# Altium schematic sheet Sheet1.SchDoc
size A1; SheetNumber: 1; SheetTotal: 1
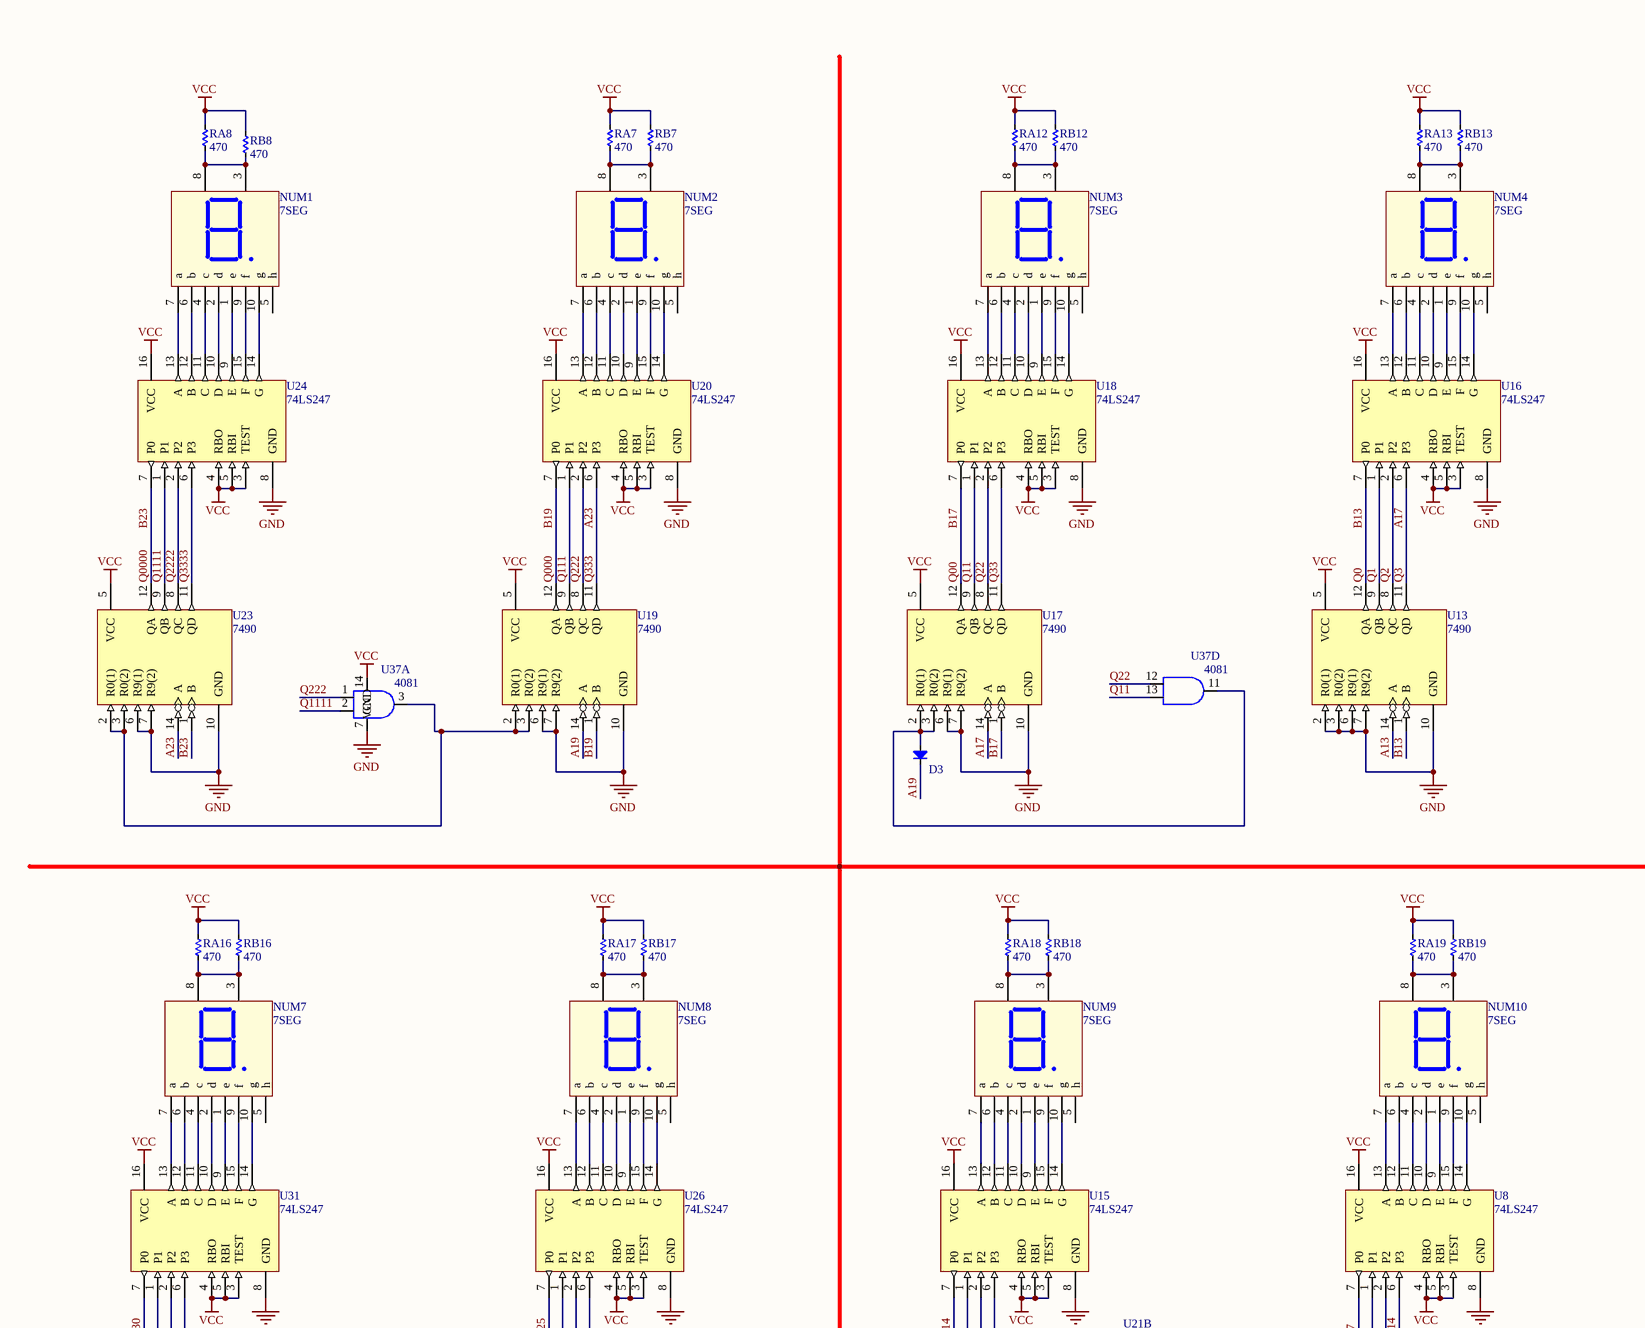
[diagram p0: Sheet1.SchDoc, top left]
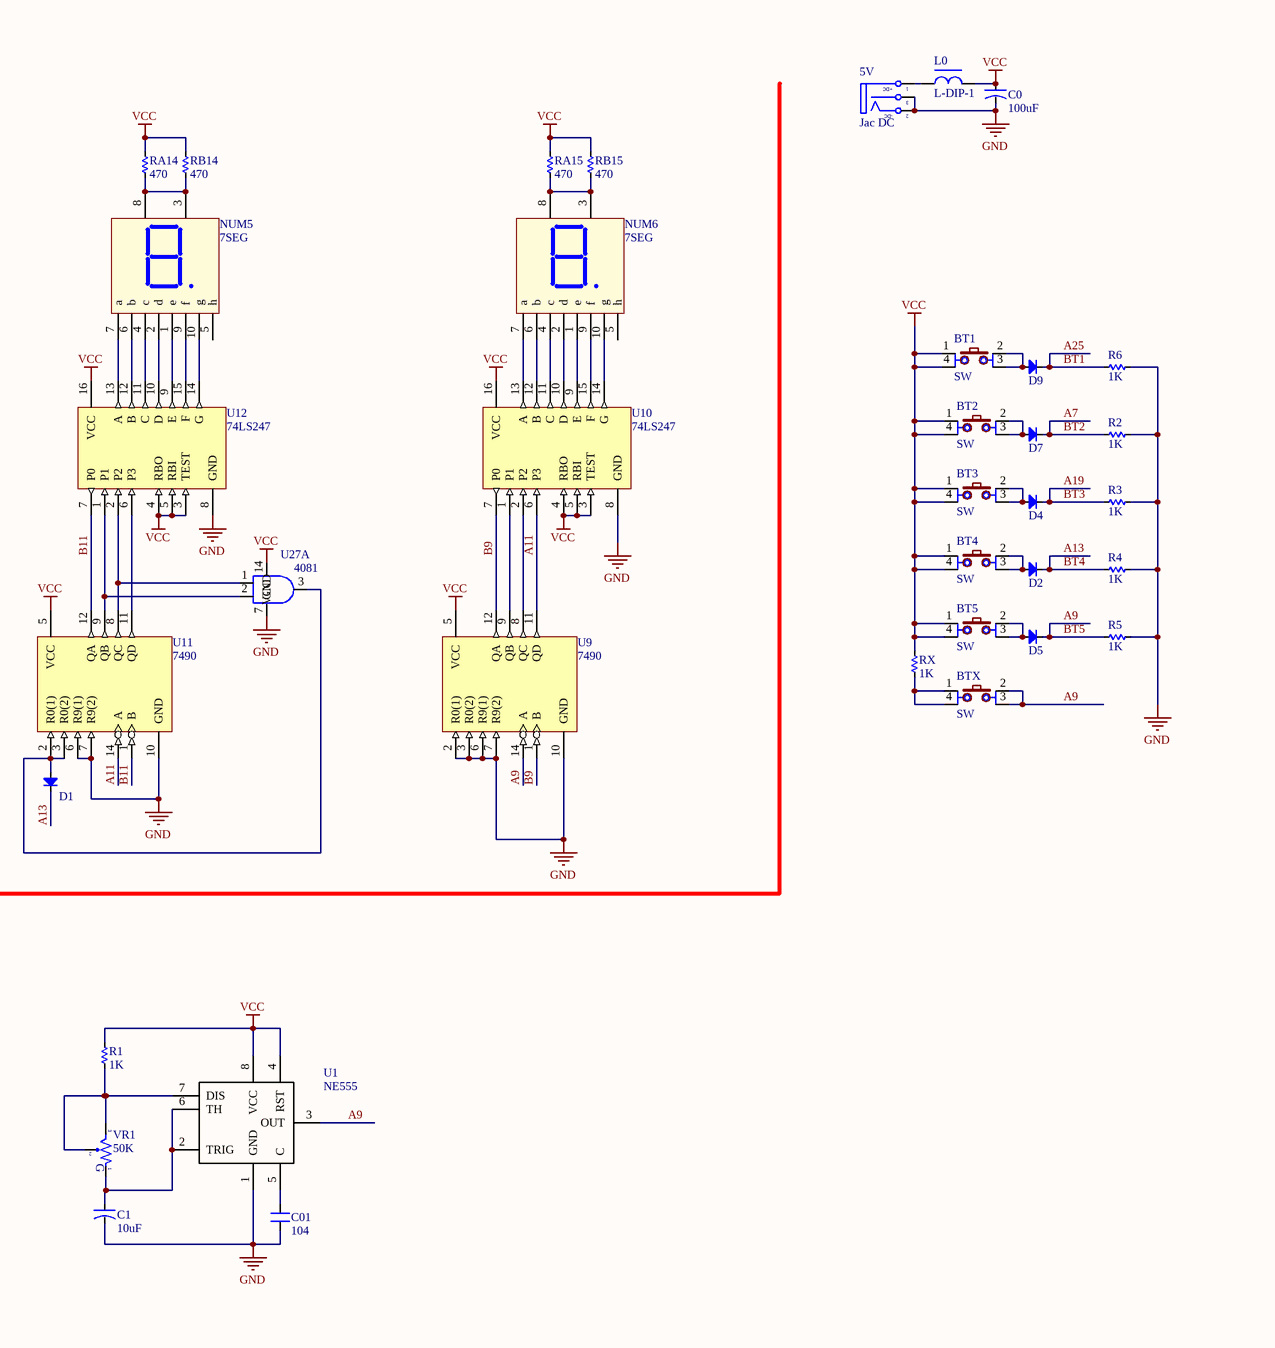
[diagram p1: Sheet1.SchDoc, top right]
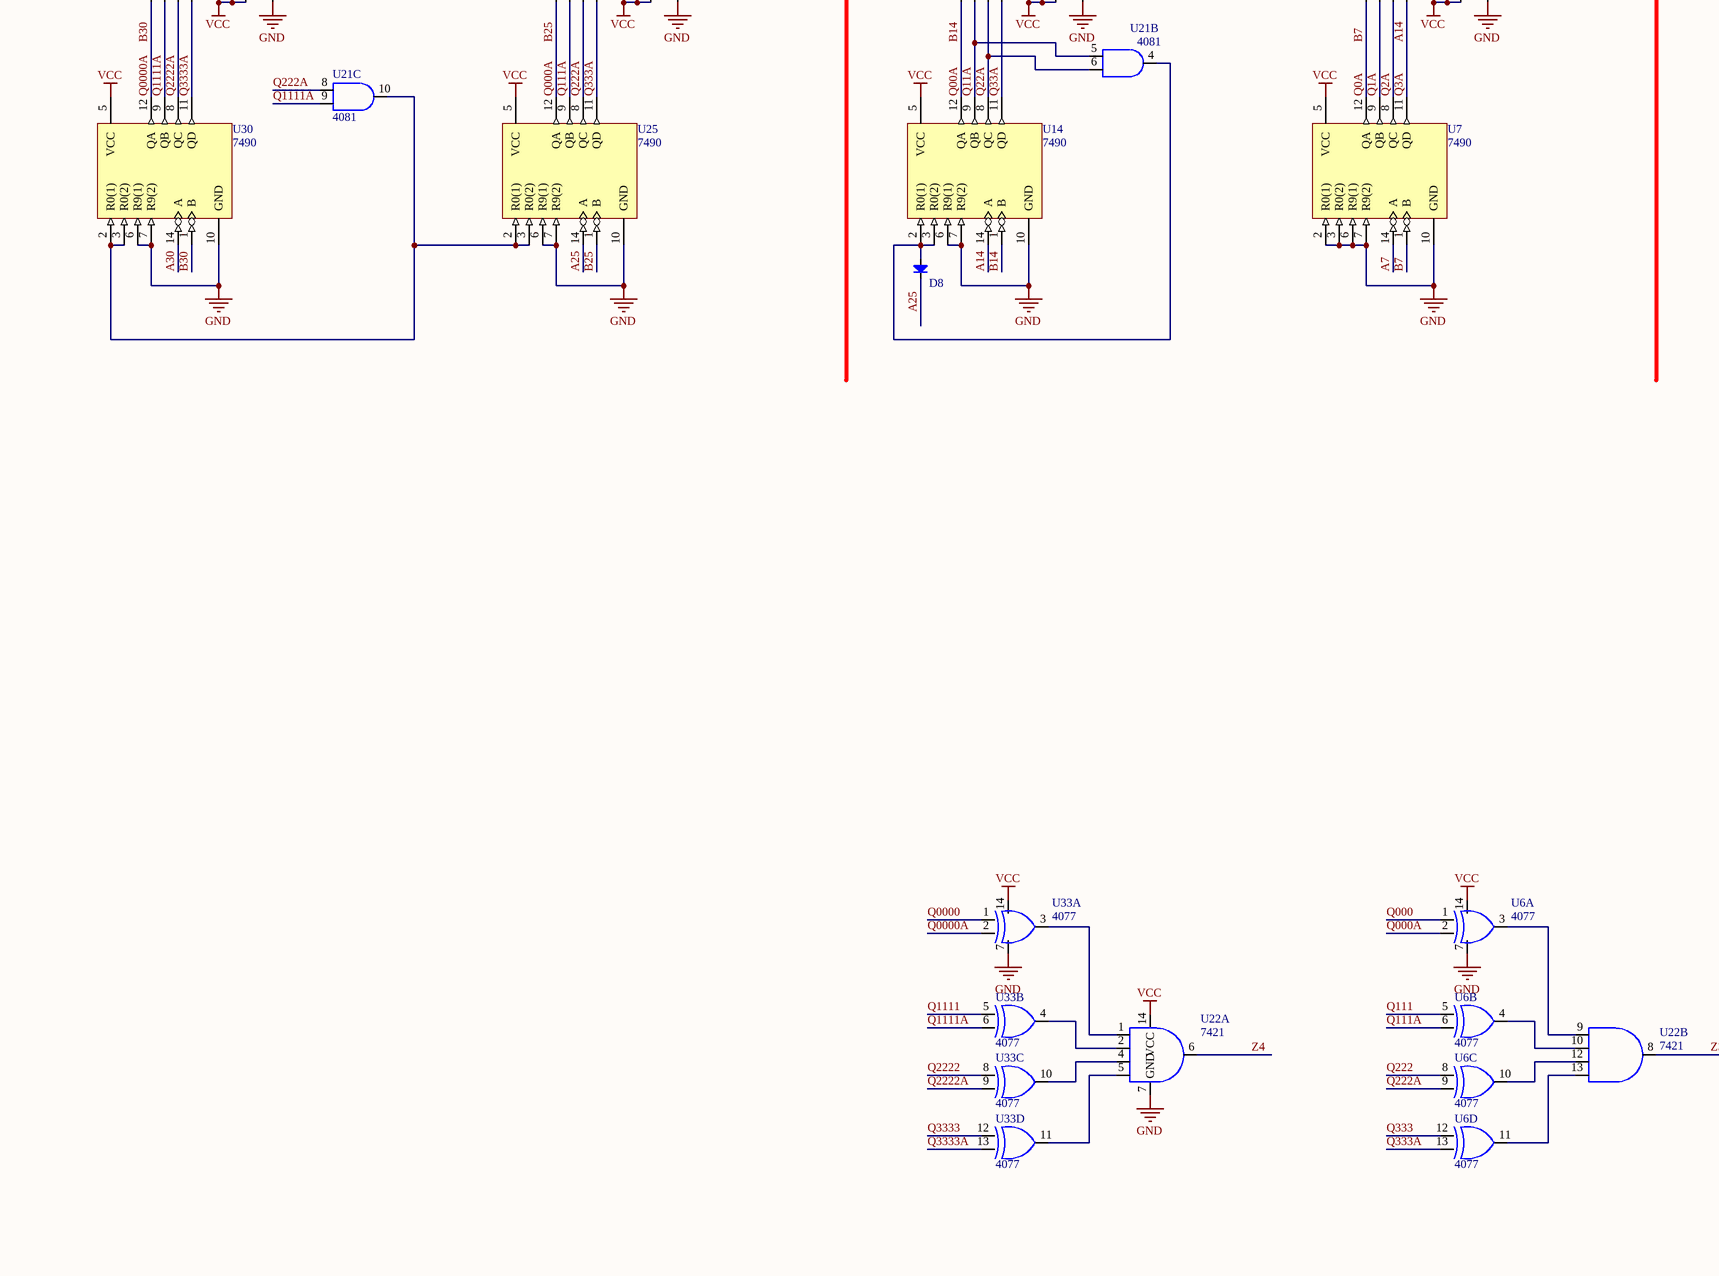
[diagram p2: Sheet1.SchDoc, bottom left]
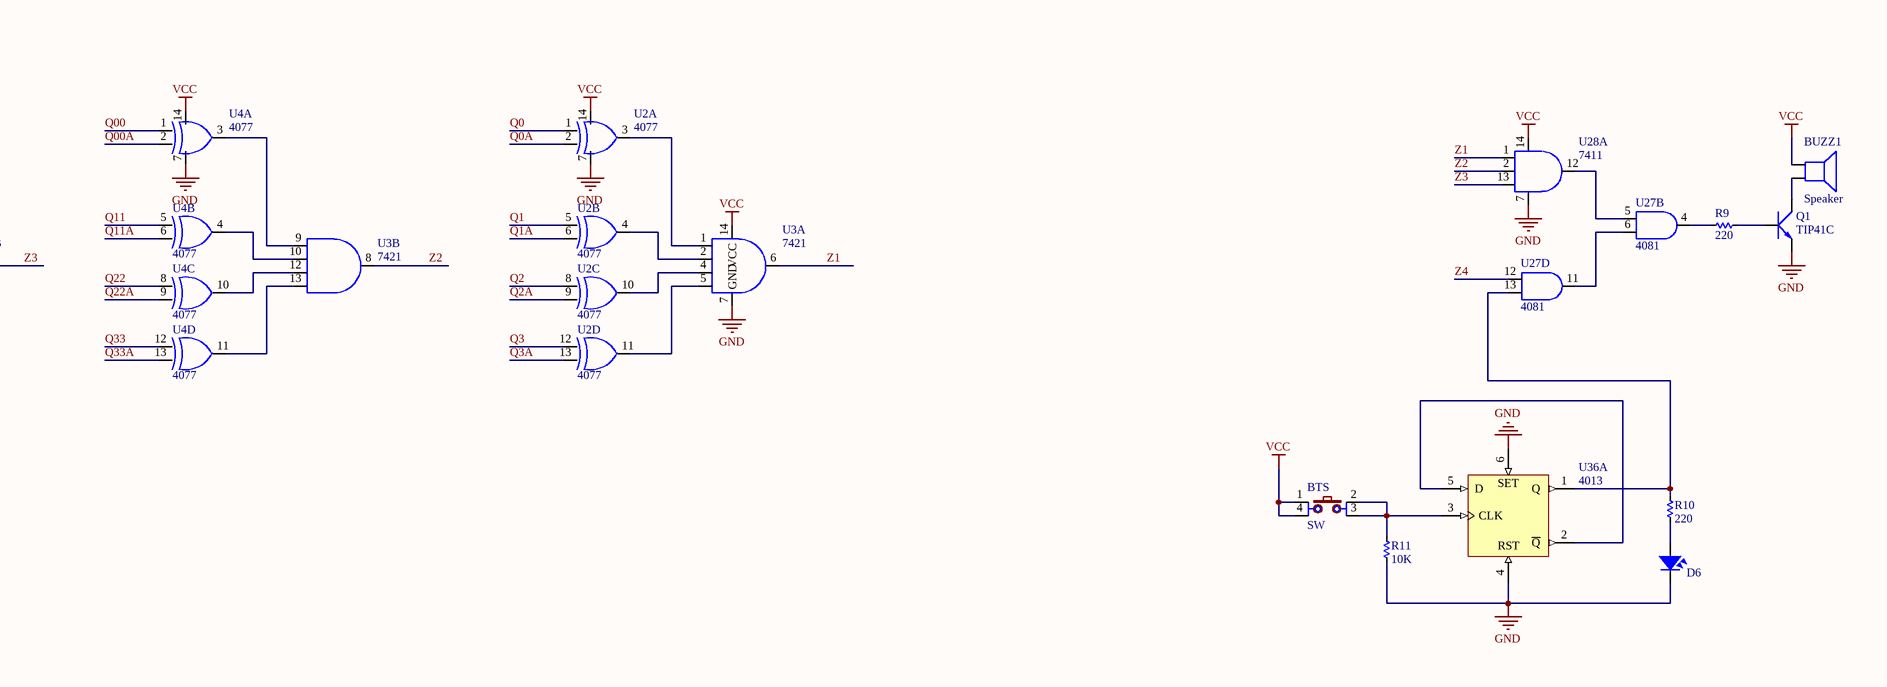
[diagram p3: Sheet1.SchDoc, bottom right]

## Parts
5V  Jac DC  [DC5]
BT1  SW  [SW2-DIP]
BT2  SW  [SW2-DIP]
BT3  SW  [SW2-DIP]
BT4  SW  [SW2-DIP]
BT5  SW  [SW2-DIP]
BTS  SW  [SW2-DIP]
BTX  SW  [SW2-DIP]
BUZZ1  Speaker  [SPEAKER]
C0  100uF  [CA-ALU-8]
C1  10uF  [CA-ALU-6.3]
C01  104  [CN1.5]
D1  Diode  [DIO-1A]  (value not drawn)
D2  Diode  [DIO-1A]  (value not drawn)
D3  Diode  [DIO-1A]  (value not drawn)
D4  Diode  [DIO-1A]  (value not drawn)
D5  Diode  [DIO-1A]  (value not drawn)
D6  LED  [LED-5-RED]  (value not drawn)
D7  Diode  [DIO-1A]  (value not drawn)
D8  Diode  [DIO-1A]  (value not drawn)
D9  Diode  [DIO-1A]  (value not drawn)
L0  L-DIP-1  [L-DIP-M-17.5x8.5]
NUM1  7SEG  [LED7SEG-1-0.56]
NUM2  7SEG  [LED7SEG-1-0.56]
NUM3  7SEG  [LED7SEG-1-0.56]
NUM4  7SEG  [LED7SEG-1-0.56]
NUM5  7SEG  [LED7SEG-1-0.56]
NUM6  7SEG  [LED7SEG-1-0.56]
NUM7  7SEG  [LED7SEG-1-0.56]
NUM8  7SEG  [LED7SEG-1-0.56]
NUM9  7SEG  [LED7SEG-1-0.56]
NUM10  7SEG  [LED7SEG-1-0.56]
Q1  TIP41C  [TO220-123]
R1  1K  [RES-1/4W]
R2  1K  [RES-1/4W]
R3  1K  [RES-1/4W]
R4  1K  [RES-1/4W]
R5  1K  [RES-1/4W]
R6  1K  [RES-1/4W]
R9  220  [RES-1/4W]
R10  220  [RES-1/4W]
R11  10K  [RES-1/4W]
RA7  470  [RES-1/4W]
RA8  470  [RES-1/4W]
RA12  470  [RES-1/4W]
RA13  470  [RES-1/4W]
RA14  470  [RES-1/4W]
RA15  470  [RES-1/4W]
RA16  470  [RES-1/4W]
RA17  470  [RES-1/4W]
RA18  470  [RES-1/4W]
RA19  470  [RES-1/4W]
RB7  470  [RES-1/4W]
RB8  470  [RES-1/4W]
RB12  470  [RES-1/4W]
RB13  470  [RES-1/4W]
RB14  470  [RES-1/4W]
RB15  470  [RES-1/4W]
RB16  470  [RES-1/4W]
RB17  470  [RES-1/4W]
RB18  470  [RES-1/4W]
RB19  470  [RES-1/4W]
RX  1K  [RES-1/4W]
U1  NE555  [DIP8]
U2  4077  [DIP14]  (parts A,B,C,D of 4)
U3  7421  [DIP14]  (parts A,B of 2)
U4  4077  [DIP14]  (parts A,B,C,D of 4)
U6  4077  [DIP14]  (parts A,B,C,D of 4)
U7  7490  [DIP14]
U8  74LS247  [DIP16]
U9  7490  [DIP14]
U10  74LS247  [DIP16]
U11  7490  [DIP14]
U12  74LS247  [DIP16]
U13  7490  [DIP14]
U14  7490  [DIP14]
U15  74LS247  [DIP16]
U16  74LS247  [DIP16]
U17  7490  [DIP14]
U18  74LS247  [DIP16]
U19  7490  [DIP14]
U20  74LS247  [DIP16]
U21  4081  [DIP14]  (parts B,C of 4)
U22  7421  [DIP14]  (parts A,B of 2)
U23  7490  [DIP14]
U24  74LS247  [DIP16]
U25  7490  [DIP14]
U26  74LS247  [DIP16]
U27  4081  [DIP14]  (parts A,B,D of 4)
U28  7411  [DIP14]  (part A of 3)
U30  7490  [DIP14]
U31  74LS247  [DIP16]
U33  4077  [DIP14]  (parts A,B,C,D of 4)
U36  4013  [DIP14]  (part A of 2)
U37  4081  [DIP14]  (parts A,D of 4)
VR1  50K  [VR-S1]

## Nets
GND: 5V.2(TN) 5V.3(S) C0.2 C01.1 C1.2 D6.2 Q1.3(E) R2.1 R3.1 R4.1 R5.1 R6.1 R11.2 U1.1(GND) U2.7(GND) U3.7(GND) U4.7(GND) U6.7(GND) U7.2(R0(1)) U7.3(R0(2)) U7.6(R9(1)) U7.7(R9(2)) U7.10(GND) U8.8(GND) U9.2(R0(1)) U9.3(R0(2)) U9.6(R9(1)) U9.7(R9(2)) U9.10(GND) U10.8(GND) U11.6(R9(1)) U11.7(R9(2)) U11.10(GND) U12.8(GND) U13.2(R0(1)) U13.3(R0(2)) U13.6(R9(1)) U13.7(R9(2)) U13.10(GND) U14.6(R9(1)) U14.7(R9(2)) U14.10(GND) U15.8(GND) U16.8(GND) U17.6(R9(1)) U17.7(R9(2)) U17.10(GND) U18.8(GND) U19.6(R9(1)) U19.7(R9(2)) U19.10(GND) U20.8(GND) U22.7(GND) U23.6(R9(1)) U23.7(R9(2)) U23.10(GND) U24.8(GND) U25.6(R9(1)) U25.7(R9(2)) U25.10(GND) U26.8(GND) U27.7(GND) U28.7(GND) U30.6(R9(1)) U30.7(R9(2)) U30.10(GND) U31.8(GND) U33.7(GND) U36.4(RST) U36.6(S) U36.7(GND) U37.7(GND)
VCC: BT1.1 BT1.4 BT2.1 BT2.4 BT3.1 BT3.4 BT4.1 BT4.4 BT5.1 BT5.4 BTS.1 BTS.4 BUZZ1.1 C0.1 L0.2 R1.1 RA7.1 RA8.1 RA12.1 RA13.1 RA14.1 RA15.1 RA16.1 RA17.1 RA18.1 RA19.1 RB7.1 RB8.1 RB12.1 RB13.1 RB14.1 RB15.1 RB16.1 RB17.1 RB18.1 RB19.1 RX.1 U1.4(RST) U1.8(VCC) U2.14(VCC) U3.14(VCC) U4.14(VCC) U6.14(VCC) U7.5(VCC) U8.3(TEST) U8.4(RBO) U8.5(RBI) U8.16(VCC) U9.5(VCC) U10.3(TEST) U10.4(RBO) U10.5(RBI) U10.16(VCC) U11.5(VCC) U12.3(TEST) U12.4(RBO) U12.5(RBI) U12.16(VCC) U13.5(VCC) U14.5(VCC) U15.3(TEST) U15.4(RBO) U15.5(RBI) U15.16(VCC) U16.3(TEST) U16.4(RBO) U16.5(RBI) U16.16(VCC) U17.5(VCC) U18.3(TEST) U18.4(RBO) U18.5(RBI) U18.16(VCC) U19.5(VCC) U20.3(TEST) U20.4(RBO) U20.5(RBI) U20.16(VCC) U22.14(VCC) U23.5(VCC) U24.3(TEST) U24.4(RBO) U24.5(RBI) U24.16(VCC) U25.5(VCC) U26.3(TEST) U26.4(RBO) U26.5(RBI) U26.16(VCC) U27.14(VCC) U28.14(VCC) U30.5(VCC) U31.3(TEST) U31.4(RBO) U31.5(RBI) U31.16(VCC) U33.14(VCC) U37.14(VCC)
VDD: U36.14(VDD)
A7: D7.2(K) R2.2 U7.14(A)  [also labelled BT2]
A9: BTX.2 BTX.3 D5.2(K) R5.2 U1.3(OUT) U9.14(A)  [also labelled BT5]
A11: U9.11(QD) U10.6(P3) U11.14(A)
A13: D1.2(K) D2.2(K) R4.2 U13.14(A)  [also labelled BT4]
A14: U2.13 U7.11(QD) U8.6(P3) U14.14(A)  [also labelled Q3A]
A17: U2.12 U13.11(QD) U16.6(P3) U17.14(A)  [also labelled Q3]
A19: D3.2(K) D4.2(K) R3.2 U19.14(A)  [also labelled BT3]
A23: U6.12 U19.11(QD) U20.6(P3) U23.14(A)  [also labelled Q333]
A25: D8.2(K) D9.2(K) R6.2 U25.14(A)  [also labelled BT1]
A30: U30.14(A)
B7: U2.2 U7.1(B) U7.12(QA) U8.7(P0)  [also labelled Q0A]
B9: U9.1(B) U9.12(QA) U10.7(P0)
B11: U11.1(B) U11.12(QA) U12.7(P0)
B13: U2.1 U13.1(B) U13.12(QA) U16.7(P0)  [also labelled Q0]
B14: U4.2 U14.1(B) U14.12(QA) U15.7(P0)  [also labelled Q00A]
B17: U4.1 U17.1(B) U17.12(QA) U18.7(P0)  [also labelled Q00]
B19: U6.1 U19.1(B) U19.12(QA) U20.7(P0)  [also labelled Q000]
B23: U23.1(B) U23.12(QA) U24.7(P0) U33.1  [also labelled Q0000]
B25: U6.2 U25.1(B) U25.12(QA) U26.7(P0)  [also labelled Q000A]
B30: U30.1(B) U30.12(QA) U31.7(P0) U33.2  [also labelled Q0000A]
Q1: U2.5 U13.9(QB) U16.1(P1)
Q1A: U2.6 U7.9(QB) U8.1(P1)
Q2: U2.8 U13.8(QC) U16.2(P2)
Q2A: U2.9 U7.8(QC) U8.2(P2)
Q11: U4.5 U17.9(QB) U18.1(P1) U37.13
Q11A: U4.6 U14.9(QB) U15.1(P1) U21.5
Q22: U4.8 U17.8(QC) U18.2(P2) U37.12
Q22A: U4.9 U14.8(QC) U15.2(P2) U21.6
Q33: U4.12 U17.11(QD) U18.6(P3)
Q33A: U4.13 U14.11(QD) U15.6(P3)
Q111: U6.5 U19.9(QB) U20.1(P1)
Q111A: U6.6 U25.9(QB) U26.1(P1)
Q222: U6.8 U19.8(QC) U20.2(P2) U37.1
Q222A: U6.9 U21.8 U25.8(QC) U26.2(P2)
Q333A: U6.13 U25.11(QD) U26.6(P3)
Q1111: U23.9(QB) U24.1(P1) U33.5 U37.2
Q1111A: U21.9 U30.9(QB) U31.1(P1) U33.6
Q2222: U23.8(QC) U24.2(P2) U33.8
Q2222A: U30.8(QC) U31.2(P2) U33.9
Q3333: U23.11(QD) U24.6(P3) U33.12
Q3333A: U30.11(QD) U31.6(P3) U33.13
Z1: U3.6 U28.1
Z2: U3.8 U28.2
Z3: U22.8 U28.13
Z4: U22.6 U27.12
Net5V_1: 5V.1(T) L0.1
NetBT1_2: BT1.2 BT1.3 D9.1(A)
NetBT2_2: BT2.2 BT2.3 D7.1(A)
NetBT3_2: BT3.2 BT3.3 D4.1(A)
NetBT4_2: BT4.2 BT4.3 D2.1(A)
NetBT5_2: BT5.2 BT5.3 D5.1(A)
NetBTS_2: BTS.2 BTS.3 R11.1 U36.3(CLK)
NetBTX_1: BTX.1 BTX.4 RX.2
NetBUZZ1_2: BUZZ1.2 Q1.2(C)
NetC1_1: C1.1 U1.2(TRIG) U1.6(TH) VR1.1
NetC01_2: C01.2 U1.5(C)
NetD1_1: D1.1(A) U11.2(R0(1)) U11.3(R0(2)) U27.3
NetD3_1: D3.1(A) U17.2(R0(1)) U17.3(R0(2)) U37.11
NetD6_1: D6.1 R10.1
NetD8_1: D8.1(A) U14.2(R0(1)) U14.3(R0(2)) U21.4
NetNUM1_1: NUM1.1(e) U24.9(E)
NetNUM1_2: NUM1.2(d) U24.10(D)
NetNUM1_3: NUM1.3(Vcc) NUM1.8(Vcc) RA8.2 RB8.2
NetNUM1_4: NUM1.4(c) U24.11(C)
NetNUM1_6: NUM1.6(b) U24.12(B)
NetNUM1_7: NUM1.7(a) U24.13(A)
NetNUM1_9: NUM1.9(f) U24.15(F)
NetNUM1_10: NUM1.10(g) U24.14(G)
NetNUM2_1: NUM2.1(e) U20.9(E)
NetNUM2_2: NUM2.2(d) U20.10(D)
NetNUM2_3: NUM2.3(Vcc) NUM2.8(Vcc) RA7.2 RB7.2
NetNUM2_4: NUM2.4(c) U20.11(C)
NetNUM2_6: NUM2.6(b) U20.12(B)
NetNUM2_7: NUM2.7(a) U20.13(A)
NetNUM2_9: NUM2.9(f) U20.15(F)
NetNUM2_10: NUM2.10(g) U20.14(G)
NetNUM3_1: NUM3.1(e) U18.9(E)
NetNUM3_2: NUM3.2(d) U18.10(D)
NetNUM3_3: NUM3.3(Vcc) NUM3.8(Vcc) RA12.2 RB12.2
NetNUM3_4: NUM3.4(c) U18.11(C)
NetNUM3_6: NUM3.6(b) U18.12(B)
NetNUM3_7: NUM3.7(a) U18.13(A)
NetNUM3_9: NUM3.9(f) U18.15(F)
NetNUM3_10: NUM3.10(g) U18.14(G)
NetNUM4_1: NUM4.1(e) U16.9(E)
NetNUM4_2: NUM4.2(d) U16.10(D)
NetNUM4_3: NUM4.3(Vcc) NUM4.8(Vcc) RA13.2 RB13.2
NetNUM4_4: NUM4.4(c) U16.11(C)
NetNUM4_6: NUM4.6(b) U16.12(B)
NetNUM4_7: NUM4.7(a) U16.13(A)
NetNUM4_9: NUM4.9(f) U16.15(F)
NetNUM4_10: NUM4.10(g) U16.14(G)
NetNUM5_1: NUM5.1(e) U12.9(E)
NetNUM5_2: NUM5.2(d) U12.10(D)
NetNUM5_3: NUM5.3(Vcc) NUM5.8(Vcc) RA14.2 RB14.2
NetNUM5_4: NUM5.4(c) U12.11(C)
NetNUM5_6: NUM5.6(b) U12.12(B)
NetNUM5_7: NUM5.7(a) U12.13(A)
NetNUM5_9: NUM5.9(f) U12.15(F)
NetNUM5_10: NUM5.10(g) U12.14(G)
NetNUM6_1: NUM6.1(e) U10.9(E)
NetNUM6_2: NUM6.2(d) U10.10(D)
NetNUM6_3: NUM6.3(Vcc) NUM6.8(Vcc) RA15.2 RB15.2
NetNUM6_4: NUM6.4(c) U10.11(C)
NetNUM6_6: NUM6.6(b) U10.12(B)
NetNUM6_7: NUM6.7(a) U10.13(A)
NetNUM6_9: NUM6.9(f) U10.15(F)
NetNUM6_10: NUM6.10(g) U10.14(G)
NetNUM7_1: NUM7.1(e) U31.9(E)
NetNUM7_2: NUM7.2(d) U31.10(D)
NetNUM7_3: NUM7.3(Vcc) NUM7.8(Vcc) RA16.2 RB16.2
NetNUM7_4: NUM7.4(c) U31.11(C)
NetNUM7_6: NUM7.6(b) U31.12(B)
NetNUM7_7: NUM7.7(a) U31.13(A)
NetNUM7_9: NUM7.9(f) U31.15(F)
NetNUM7_10: NUM7.10(g) U31.14(G)
NetNUM8_1: NUM8.1(e) U26.9(E)
NetNUM8_2: NUM8.2(d) U26.10(D)
NetNUM8_3: NUM8.3(Vcc) NUM8.8(Vcc) RA17.2 RB17.2
NetNUM8_4: NUM8.4(c) U26.11(C)
NetNUM8_6: NUM8.6(b) U26.12(B)
NetNUM8_7: NUM8.7(a) U26.13(A)
NetNUM8_9: NUM8.9(f) U26.15(F)
NetNUM8_10: NUM8.10(g) U26.14(G)
NetNUM9_1: NUM9.1(e) U15.9(E)
NetNUM9_2: NUM9.2(d) U15.10(D)
NetNUM9_3: NUM9.3(Vcc) NUM9.8(Vcc) RA18.2 RB18.2
NetNUM9_4: NUM9.4(c) U15.11(C)
NetNUM9_6: NUM9.6(b) U15.12(B)
NetNUM9_7: NUM9.7(a) U15.13(A)
NetNUM9_9: NUM9.9(f) U15.15(F)
NetNUM9_10: NUM9.10(g) U15.14(G)
NetNUM10_1: NUM10.1(e) U8.9(E)
NetNUM10_2: NUM10.2(d) U8.10(D)
NetNUM10_3: NUM10.3(Vcc) NUM10.8(Vcc) RA19.2 RB19.2
NetNUM10_4: NUM10.4(c) U8.11(C)
NetNUM10_6: NUM10.6(b) U8.12(B)
NetNUM10_7: NUM10.7(a) U8.13(A)
NetNUM10_9: NUM10.9(f) U8.15(F)
NetNUM10_10: NUM10.10(g) U8.14(G)
NetQ1_1: Q1.1(B) R9.1
NetR1_2: R1.2 U1.7(DIS) VR1.2 VR1.3
NetR9_2: R9.2 U27.4
NetR10_2: R10.2 U27.13 U36.1(Q)
NetU2_3: U2.3 U3.1
NetU2_4: U2.4 U3.2
NetU2_10: U2.10 U3.4
NetU2_11: U2.11 U3.5
NetU3_9: U3.9 U4.3
NetU3_10: U3.10 U4.4
NetU3_12: U3.12 U4.10
NetU3_13: U3.13 U4.11
NetU6_3: U6.3 U22.9
NetU6_4: U6.4 U22.10
NetU6_10: U6.10 U22.12
NetU6_11: U6.11 U22.13
NetU9_8: U9.8(QC) U10.2(P2)
NetU9_9: U9.9(QB) U10.1(P1)
NetU11_8: U11.8(QC) U12.2(P2) U27.1
NetU11_9: U11.9(QB) U12.1(P1) U27.2
NetU11_11: U11.11(QD) U12.6(P3)
NetU19_2: U19.2(R0(1)) U19.3(R0(2)) U23.2(R0(1)) U23.3(R0(2)) U37.3
NetU21_10: U21.10 U25.2(R0(1)) U25.3(R0(2)) U30.2(R0(1)) U30.3(R0(2))
NetU22_1: U22.1 U33.3
NetU22_2: U22.2 U33.4
NetU22_4: U22.4 U33.10
NetU22_5: U22.5 U33.11
NetU27_5: U27.5 U28.12
NetU27_6: U27.6 U27.11
NetU36_2: U36.2(~{Q}) U36.5(D)

Not connected (* = marked no-connect by the designer): NUM1 5(h); NUM2 5(h); NUM3 5(h); NUM4 5(h); NUM5 5(h); NUM6 5(h); NUM7 5(h); NUM8 5(h); NUM9 5(h); NUM10 5(h)

## Notes on the sheet
- (in symbol 4013, part A) SET
- (in symbol DCIN) +DC; -DC
- (in symbol VR-S) G

## Library data of the parts
5V = DCIN: Jac DC input; Value: Jac DC
BT1-BT5 BTS BTX = SW4: Switch button 4 pin; Value: Button chip 4 pin
BUZZ1 = Speaker: Loudspeaker; Published: 24-Mar-1999; LatestRevisionDate: 17-Jul-2002; LatestRevisionNote: Re-released for DXP Platform.; PackageReference: PIN2; Publisher: Altium Limited
C0 C1 = CN-ALU-DIP: Capacitor (Semiconductor SIM Model); Value: 104; LatestRevisionDate: 17-Jul-2002; LatestRevisionNote: Re-released for DXP Platform.; PackageReference: C1206; Publisher: Altium Limited
C01 = CN: Value: 33pF
D1-D5 D7-D9 = Diode: Default Diode; Code - JEDEC: DO-214-AB; Value: 1N5007; Published: 8-Jun-2000; Revision: July-2002: Re-released for DXP Platform.; Publisher: Altium Limited
D6 = LED: LED Single colour Green and Red; Value: LED 3 ly Single Colour
L0 = L-DIP-1: Inductor; Value: 150 mH
NUM1-NUM10 = LED7SEG-1: 14.2 mm General Purpose Blue 7-Segment Display: CC, RH DP, Gray Surface; MinimumIntensity: 2020 ucd; Note: IF = 10 mA; Published: 8-Jun-2000; LatestRevisionDate: 17-Dec-2003; LatestRevisionNote: Schematic revised, PCB Footprint replaced.; DatasheetDocument: 24-Sep-2002; PackageDocument: 24-Sep-2002; PackageReference: H; Publisher: Altium Limited; Colour: Blue; ComponentLink1Description: Manufacturer Link; ComponentLink1URL: http://www.agilent.com/
Q1 = TIP41C: NPN 2W, BCE; Value: TIP41C
R1-R6 R9-R11 RA7 RA8 RA12-RA19 RB7 RB8 RB12-RB19 RX = Res: Manufacturer: Generic Components; Class: Passive; SubClass: R; Published: 08/06/2000; Publisher: Altium Hobart Technology Centre
U1 = NE555: TIMER IC; Manufacturer Part Number: NE555DT; Manufacturer: STMicroelectronics; Frequency: 500kHz; Voltage - Supply: 4.5 V ~ 16 V; Current: 200mA; Supplier 1: Digi-Key; Supplier Part Number 1: 497-1962-2-ND; Supplier: Digi-Key; Category: Integrated Circuits (ICs); Supplier Part Number: 497-1962-2-ND; Package / Case: 8-SOIC (3.9mm Width); Packaging: Tape & Reel (TR); RoHS: RoHS Compliant; Operating Temperature: 0°C ~ 70°C; Count: -; Type: 555 Type, Timer/Oscillator (Single)
U7 U9 U11 U13 U14 U17 U19 U23 U25 U30 = 7490: 4-Bit Decade Counter; Value: 7490
U8 U10 U12 U15 U16 U18 U20 U24 U26 U31 = 74247: Value: 74LS238; Copyright by: VanDungEvn@Gmail.com
U36 = 4013: Dual D-Type Flip-Flop; Creat by: VanDungEvn@Gmail.com
VR1 = VR-S: Var Resistor; Value: Volume 50k